# Altium schematic sheet Boostconverter.SchDoc
size A; SPICEModelCacheSOABBTUJ: <root> / <DocumentId>SOABBTUJ</DocumentId> / <CacheFrame Number="0"> / <Model Name="cap" Kind="MDL"> / <Text>*Default semiconductor capacitor / .MODEL CAP C()</Text> / </Model> / </CacheFrame> / </root>
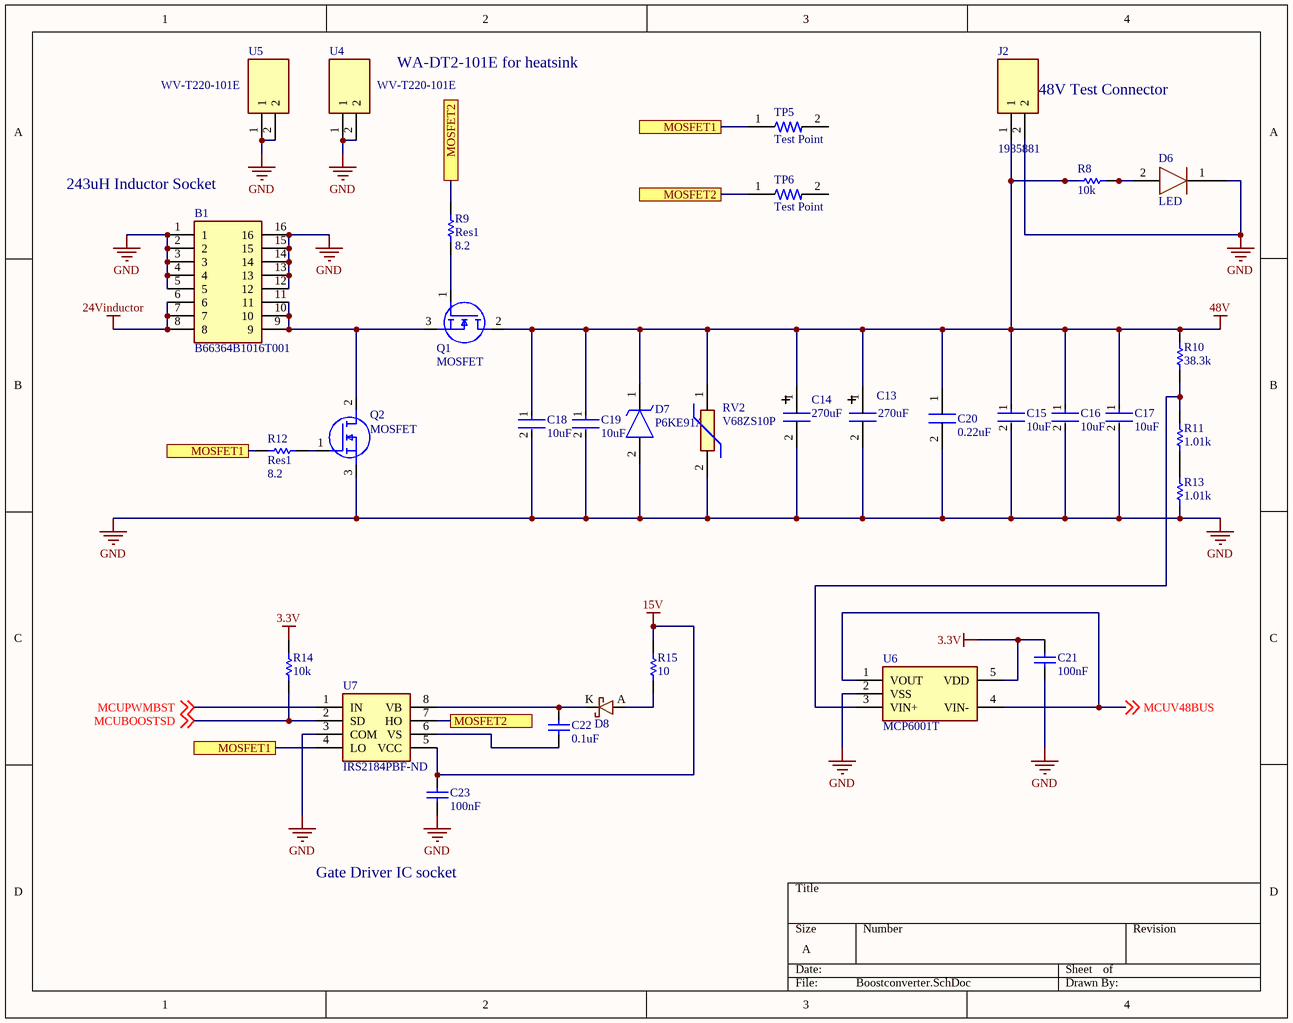
[diagram p0: Boostconverter.SchDoc]

## Parts
B1  B66364B1016T001  [B66364B1016T001]
C13  270uF  [100TXW270MEFC10X50]
C14  270uF  [100TXW270MEFC10X50]
C15  10uF  [FP-CL31-IPC_C]
C16  10uF  [FP-CL31-IPC_C]
C17  10uF  [FP-CL31-IPC_C]
C18  10uF  [FP-CL31-IPC_C]
C19  10uF  [FP-CL31-IPC_C]
C20  0.22uF  [B32652A3224K000]
C21  100nF  [CAPC1609X100X15LL20]
C22  0.1uF  [CAPC1609X100X15LL20]
C23  100nF  [CAPC1609X100X15LL20]
D6  LED  [LED 0603]
D7  P6KE91A  [DIOAD1910W86L670D310]
D8  SB3H100-E3_54  [SB3H100-E3/54GICT-ND]  (value not drawn)
J2  1985881  [1985881]
Q1  MOSFET  [TO254P457X1003X2115-3P]
Q2  MOSFET  [TO254P457X1003X2115-3P]
R8  10k  [RESC1609X50X30NL8T20]
R9  Res1  value 8.2  [1210]
R10  38.3k  [RESC1609X50X30NL8T20]
R11  1.01k  [RESC1609X50X30NL8T20]
R12  Res1  value 8.2  [1210]
R13  1.01k  [RESC1609X50X30NL8T20]
R14  10k  [RESC1609X50X30NL8T20]
R15  10  [RESC1609X50X30NL8T20]
RV2  V68ZS10P  [V68ZS10P]
TP5  Test Point  [RESC3216X70N]
TP6  Test Point  [RESC3216X70N]
U4  WV-T220-101E  [WVT220101E]
U5  WV-T220-101E  [WVT220101E]
U6  MCP6001T  [SOT-23]
U7  IRS2184PBF-ND  [DIP8]

## Ports
MOSFET1, MOSFET2

## Nets
3.3V: C21.1 R14.2 U6.5(VDD)
15V: C23.2 R15.2 U7.5(VCC)
24Vinductor: B1.6 B1.7 B1.8
48V: C13.1 C14.1 C15.1 C16.1 C17.1 C18.1 C19.1 C20.1 D7.1(K) J2.1 Q1.2(D) R8.1 R10.2 RV2.1
GND: B1.1 B1.2 B1.3 B1.4 B1.5 B1.12 B1.13 B1.14 B1.15 B1.16 C13.2 C14.2 C15.2 C16.2 C17.2 C18.2 C19.2 C20.2 C21.2 C23.1 D6.1 D7.2(A) J2.2 Q2.3(S) R13.1 RV2.2 U4.1 U4.2 U5.1 U5.2 U6.2(VSS) U7.3(COM)
MCUBOOSTSD: R14.1 U7.2(SD) ; off-sheet MCUBOOSTSD
MCUPWMBST: U7.1(IN) ; off-sheet MCUPWMBST
MCUV48BUS: U6.1(VOUT) U6.4(VIN-) ; off-sheet MCUV48BUS
MOSFET1: R12.2 TP5.1 U7.4(LO) ; port MOSFET1
MOSFET2: R9.2 TP6.1 U7.7(HO) ; port MOSFET2
NetB1_9: B1.9 B1.10 B1.11 Q1.3(S) Q2.2(D)
NetC22_1: C22.1 U7.6(VS)
NetC22_2: C22.2 D8.K U7.8(VB)
NetD6_2: D6.2 R8.2
NetD8_A: D8.A R15.1
NetQ1_1: Q1.1(G) R9.1
NetQ2_1: Q2.1(G) R12.1
NetR10_1: R10.1 R11.2 U6.3(VIN+)
NetR11_1: R11.1 R13.2

Not connected (* = marked no-connect by the designer): TP5 2; TP6 2

## Notes on the sheet
- WA-DT2-101E for heatsink
- (near J2) 48V Test Connector
- (near B1) 243uH Inductor Socket
- Gate Driver IC socket

## Library data of the parts
B1 = B66364B1016T001: Bobbin; Manufacturer_Name: EPCOS; Datasheet Link: https://componentsearchengine.com/Datasheets/1/B66364B1016T001.pdf; Height: 35.5mm; Mouser2 Part Number: 871-B66364B1016T001; Mouser2 Price/Stock: https://www.mouser.com/Search/Refine.aspx?Keyword=871-B66364B1016T001; Manufacturer_Part_Number: B66364B1016T001
C13 C14 = 100TXW270MEFC10X50: Capacitor, 10mm, 5mm leads
C15-C19 = CMP-13271-001211-1: Cap Ceramic 220pF 500V C0G ±5% SMD 1206 +125°C Embossed T/R CL31C221JGFNNNF; Tolerance: 5%; Voltage Rating (DC): 500V; Depth: 1.6mm; Capacitance: 220pF; Max Operating Temperature: 125°C; Width: 0.063inch; Radiation Hardening: No; Thickness: 0.055inch; Packaging: Tape and Reel; Height: 1.25mm; Case/Package: 1206; Package Quantity: 10000; Dielectric: C0G; Mount: Surface Mount; Voltage Rating: 500V; Min Operating Temperature: -55°C; Length: 3.2mm
C20 = B32652A3224K000: Capacitor, Film, 15mm leads
C21-C23 = CMP-2006-00186-1: Manufacturer: AVX Interconnect / Elco; Part Number: TACL105M006XTA
D6 = LED: LED SMD
D7 = P6KE91A-E3_54: TVS Diode (Uni-directional); Manufacturer_Name: Vishay; Manufacturer_Part_Number: P6KE91A-E3/54; Datasheet Link: https://www.mouser.com/datasheet/2/427/p6ke-1767850.pdf
D8 = SB3H100-E3_54: Schottky Diode
J2 = 1985881: Connector; Manufacturer_Name: Phoenix Contact; Datasheet Link: https://www.digikey.com/en/products/detail/phoenix-contact/1985881/2511015; Height: 13.9mm; Manufacturer_Part_Number: 1985881; Mouser Part Number: 651-1985881; Mouser Price/Stock: https://www.mouser.co.uk/ProductDetail/Phoenix-Contact/1985881?qs=YbgdthCBnKfqOEwK0VcNyQ%3D%3D; Arrow Part Number: 1985881; Arrow Price/Stock: https://www.arrow.com/en/products/1985881/phoenix-contact?region=nac
Q1 Q2 = IPP200N15N3GXKSA1: MOSFET (N-Channel) IPP200N15N3GXKSA1; Manufacturer_Name: Infineon; Datasheet Link: https://www.infineon.com/dgdl/Infineon-IPD_BIP_200N15N3-DS-v02_07-en.pdf?fileId=db3a304319c6f18c0119cd1cc23279be; Height: 4.57mm; Manufacturer_Part_Number: IPP200N15N3GXKSA1; Mouser Part Number: 726-IPP200N15N3GXKSA; Mouser Price/Stock: https://www.mouser.co.uk/ProductDetail/Infineon-Technologies/IPP200N15N3GXKSA1?qs=OwbwYO03UsIZDVgU5L%2FaDg%3D%3D; Arrow Part Number: IPP200N15N3GXKSA1; Arrow Price/Stock: https://www.arrow.com/en/products/ipp200n15n3gxksa1/infineon-technologies-ag
R8 R10 R11 R13-R15 = CMP-2000-03816-5: Chip Resistor, 0 Ohm, Jumper, 100 mW, -55 to 155 degC, 0603 (1608 Metric), RoHS, Tape and Reel; Manufacturer: Vishay Semiconductor; Voltage Rating: 75 V; Package Quantity: 5000; DatasheetVersion: 06/2012; Min Operating Temperature: -55 degC; ComponentLink1URL: http://www.vishay.com/; Mounting Technology: Surface Mount; Height: 0.45 mm; ComponentLink1Description: Manufacturer URL; REACH SVHC: Unknown; PackageReference: 0603; Packaging: Tape and Reel; Max Operating Temperature: 155 degC; Mount: Surface Mount; ComponentLink2Description: Datasheet; PackageDescription: 2-Pin Surface Mount Device, Body 1.575 x 0.85 mm; Length: 1.55 mm; ComponentLink2URL: http://www.vishay.com/docs/20035/dcrcwe3.pdf; Pins: 2; RoHSCompliant: true
R9 R12 = Res1: Resistor; Published: 8-Jun-2000; LatestRevisionDate: 17-Jul-2002; LatestRevisionNote: Re-released for DXP Platform.; PackageReference: AXIAL-0.3; Publisher: Altium Limited; PackageDescription: Axial Device, Thru-Hole; 2 Leads; 0.3 in Pin Spacing
RV2 = V68ZS10P: Varistor; Manufacturer_Name: LITTELFUSE; Datasheet Link: http://www.littelfuse.com/~/media/electronics/datasheets/varistors/littelfuse_varistor_za_datasheet.pdf.pdf; Height: 20mm; Manufacturer_Part_Number: V68ZS10P; Mouser Part Number: 576-V68ZS10P; Mouser Price/Stock: https://www.mouser.co.uk/ProductDetail/Littelfuse/V68ZS10P?qs=1%2FWRN91BpNvIRlTsONWDiQ%3D%3D
TP5 TP6 = RCWCTE: PC Test Point , Plating Surface Mount Mounting Type; MF: KOA Speer; Package: 1206 KOA Speer; Value: *; Price: None; Availability: Unavailable; MP: RCWCTE; SnapEDA_Link: https://www.snapeda.com/parts/RCWCTE/KOA%20Speer/view-part/1310479/?ref=snap
U4 U5 = WV-T220-101E: Undefined or Miscellaneous; Manufacturer_Name: Ohmite; Datasheet Link: http://www.ohmite.com/assets/docs/sink_w.pdf?r=false; Height: 32.3mm; Manufacturer_Part_Number: WV-T220-101E; Mouser Part Number: 588-WV-T220-101E; Mouser Price/Stock: https://www.mouser.com/Search/Refine.aspx?Keyword=588-WV-T220-101E
U6 = MCP6001T: Op-Amp
U7 = IRS2184PBF-ND: Boost Driver; Manufacturer_Name: Amphenol; Manufacturer_Part_Number: DILB8P-223TLF; Datasheet Link: https://componentsearchengine.com/Datasheets/1/DILB8P-223TLF.pdf; Height: 5.25mm; Mouser2 Part Number: 649-DILB8P223TLF; Mouser2 Price/Stock: https://www.mouser.com/Search/Refine.aspx?Keyword=649-DILB8P223TLF